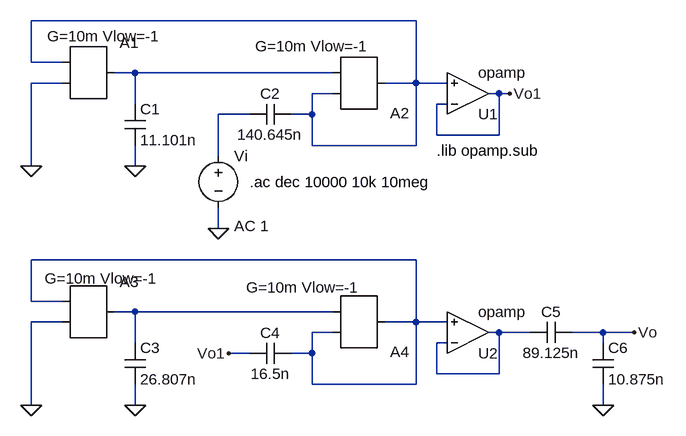
[diagram p0: schematic Ej_8_v2.asc]
Ej_8_v2.asc, the LTspice schematic file:
Version 4
SHEET 1 1008 680
WIRE 608 -16 16 -16
WIRE 16 48 16 -16
WIRE 64 48 16 48
WIRE 176 64 144 64
WIRE 480 64 176 64
WIRE 64 80 16 80
WIRE 608 80 608 -16
WIRE 608 80 560 80
WIRE 656 80 608 80
WIRE 480 96 448 96
WIRE 736 96 720 96
WIRE 752 96 736 96
WIRE 176 112 176 64
WIRE 656 112 640 112
WIRE 352 128 304 128
WIRE 448 128 448 96
WIRE 448 128 416 128
WIRE 640 160 640 112
WIRE 736 160 736 96
WIRE 736 160 640 160
WIRE 448 176 448 128
WIRE 608 176 608 80
WIRE 608 176 448 176
WIRE 304 192 304 128
WIRE 16 208 16 80
WIRE 176 208 176 176
WIRE 304 304 304 272
WIRE 608 352 16 352
WIRE 16 416 16 352
WIRE 64 416 16 416
WIRE 176 432 144 432
WIRE 480 432 176 432
WIRE 64 448 16 448
WIRE 608 448 608 352
WIRE 608 448 560 448
WIRE 656 448 608 448
WIRE 480 464 448 464
WIRE 736 464 720 464
WIRE 784 464 736 464
WIRE 896 464 848 464
WIRE 944 464 896 464
WIRE 176 480 176 432
WIRE 656 480 640 480
WIRE 896 480 896 464
WIRE 352 496 320 496
WIRE 448 496 448 464
WIRE 448 496 416 496
WIRE 640 528 640 480
WIRE 736 528 736 464
WIRE 736 528 640 528
WIRE 448 544 448 496
WIRE 608 544 608 448
WIRE 608 544 448 544
WIRE 16 576 16 448
WIRE 176 576 176 544
WIRE 896 576 896 544
FLAG 176 208 0
FLAG 304 304 0
FLAG 16 208 0
FLAG 176 576 0
FLAG 16 576 0
FLAG 752 96 Vo1
FLAG 320 496 Vo1
FLAG 944 464 Vo
FLAG 896 576 0
SYMBOL voltage 304 176 R0
WINDOW 123 24 124 Left 2
WINDOW 39 0 0 Left 0
SYMATTR Value2 AC 1
SYMATTR InstName Vi
SYMATTR Value ""
SYMBOL SpecialFunctions\\ota 96 0 R0
WINDOW 3 -55 8 Left 2
SYMATTR Value G=10m Vlow=-1
SYMATTR InstName A1
SYMBOL SpecialFunctions\\ota 512 144 M180
WINDOW 3 -151 121 Left 2
SYMATTR Value G=10m Vlow=-1
SYMATTR InstName A2
SYMBOL cap 160 112 R0
SYMATTR InstName C1
SYMATTR Value 11.101n
SYMBOL cap 416 112 R90
WINDOW 0 0 32 VBottom 2
WINDOW 3 32 32 VTop 2
SYMATTR InstName C2
SYMATTR Value 140.645n
SYMBOL SpecialFunctions\\ota 96 368 R0
WINDOW 3 -59 13 Left 2
SYMATTR Value G=10m Vlow=-1
SYMATTR InstName A3
SYMBOL SpecialFunctions\\ota 512 512 M180
WINDOW 3 -165 117 Left 2
SYMATTR Value G=10m Vlow=-1
SYMATTR InstName A4
SYMBOL cap 160 480 R0
SYMATTR InstName C3
SYMATTR Value 26.807n
SYMBOL cap 416 480 R90
WINDOW 0 0 32 VBottom 2
WINDOW 3 32 32 VTop 2
SYMATTR InstName C4
SYMATTR Value 16.5n
SYMBOL OpAmps\\opamp 688 160 M180
SYMATTR InstName U1
SYMATTR SpiceLine2 GBW=1000Meg
SYMBOL OpAmps\\opamp 688 528 M180
SYMATTR InstName U2
SYMATTR SpiceLine2 GBW=1000Meg
SYMBOL cap 848 448 R90
WINDOW 0 0 32 VBottom 2
WINDOW 3 32 32 VTop 2
SYMATTR InstName C5
SYMATTR Value 89.125n
SYMBOL cap 880 480 R0
SYMATTR InstName C6
SYMATTR Value 10.875n
TEXT 352 232 Left 2 !.ac dec 10000 10k 10meg
TEXT 640 184 Left 2 !.lib opamp.sub

The netlist it stands for:
* Ej_8_v2.asc
Vi N003 0 AC 1
A1 N001 0 0 0 0 0 N002 0 OTA G=10m Vlow=-1
A2 N001 N002 0 0 0 0 N001 0 OTA G=10m Vlow=-1
C1 N002 0 11.101n
C2 N001 N003 140.645n
A3 N004 0 0 0 0 0 N005 0 OTA G=10m Vlow=-1
A4 N004 N005 0 0 0 0 N004 0 OTA G=10m Vlow=-1
C3 N005 0 26.807n
C4 N004 Vo1 16.5n
XU1 Vo1 N001 Vo1 opamp Aol=100K GBW=1000Meg  ; pins invin noninvin out
XU2 N006 N004 N006 opamp Aol=100K GBW=1000Meg  ; pins invin noninvin out
C5 Vo N006 89.125n
C6 Vo 0 10.875n
.ac dec 10000 10k 10meg
.lib opamp.sub
.backanno
.end